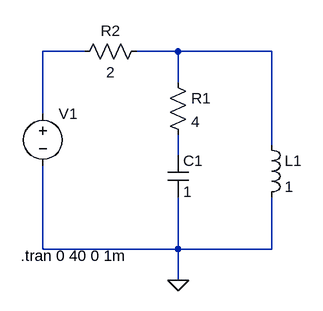
[diagram p0: schematic Draft8.asc]
Draft8.asc, the LTspice schematic file:
Version 4
SHEET 1 880 680
WIRE -16 -32 -80 -32
WIRE 128 -32 64 -32
WIRE 272 -32 128 -32
WIRE 128 16 128 -32
WIRE -80 64 -80 -32
WIRE 272 112 272 -32
WIRE 128 128 128 96
WIRE -80 272 -80 144
WIRE 128 272 128 192
WIRE 128 272 -80 272
WIRE 272 272 272 192
WIRE 272 272 128 272
WIRE 128 320 128 272
FLAG 128 320 0
SYMBOL ind 256 96 R0
SYMATTR InstName L1
SYMATTR Value 1
SYMATTR SpiceLine Rser=1f
SYMBOL res 112 0 R0
SYMATTR InstName R1
SYMATTR Value 4
SYMBOL res 80 -48 R90
WINDOW 0 0 56 VBottom 2
WINDOW 3 32 56 VTop 2
SYMATTR InstName R2
SYMATTR Value 2
SYMBOL cap 112 128 R0
SYMATTR InstName C1
SYMATTR Value 1
SYMBOL voltage -80 48 R0
WINDOW 3 24 96 Invisible 2
WINDOW 123 0 0 Left 0
WINDOW 39 0 0 Left 0
SYMATTR InstName V1
SYMATTR Value SINE(0 10 0.795774715459 0 0 90)
TEXT -114 282 Left 2 !.tran 0 40 0 1m

The netlist it stands for:
* Draft8.asc
L1 N002 0 1 Rser=1f
R1 N002 N003 4
R2 N002 N001 2
C1 N003 0 1
V1 N001 0 SINE(0 10 0.795774715459 0 0 90)
.tran 0 40 0 1m
.backanno
.end